# Altium schematic sheet LV_Schematic.SchDoc
size A3; SheetNumber: 1; SheetTotal: 1
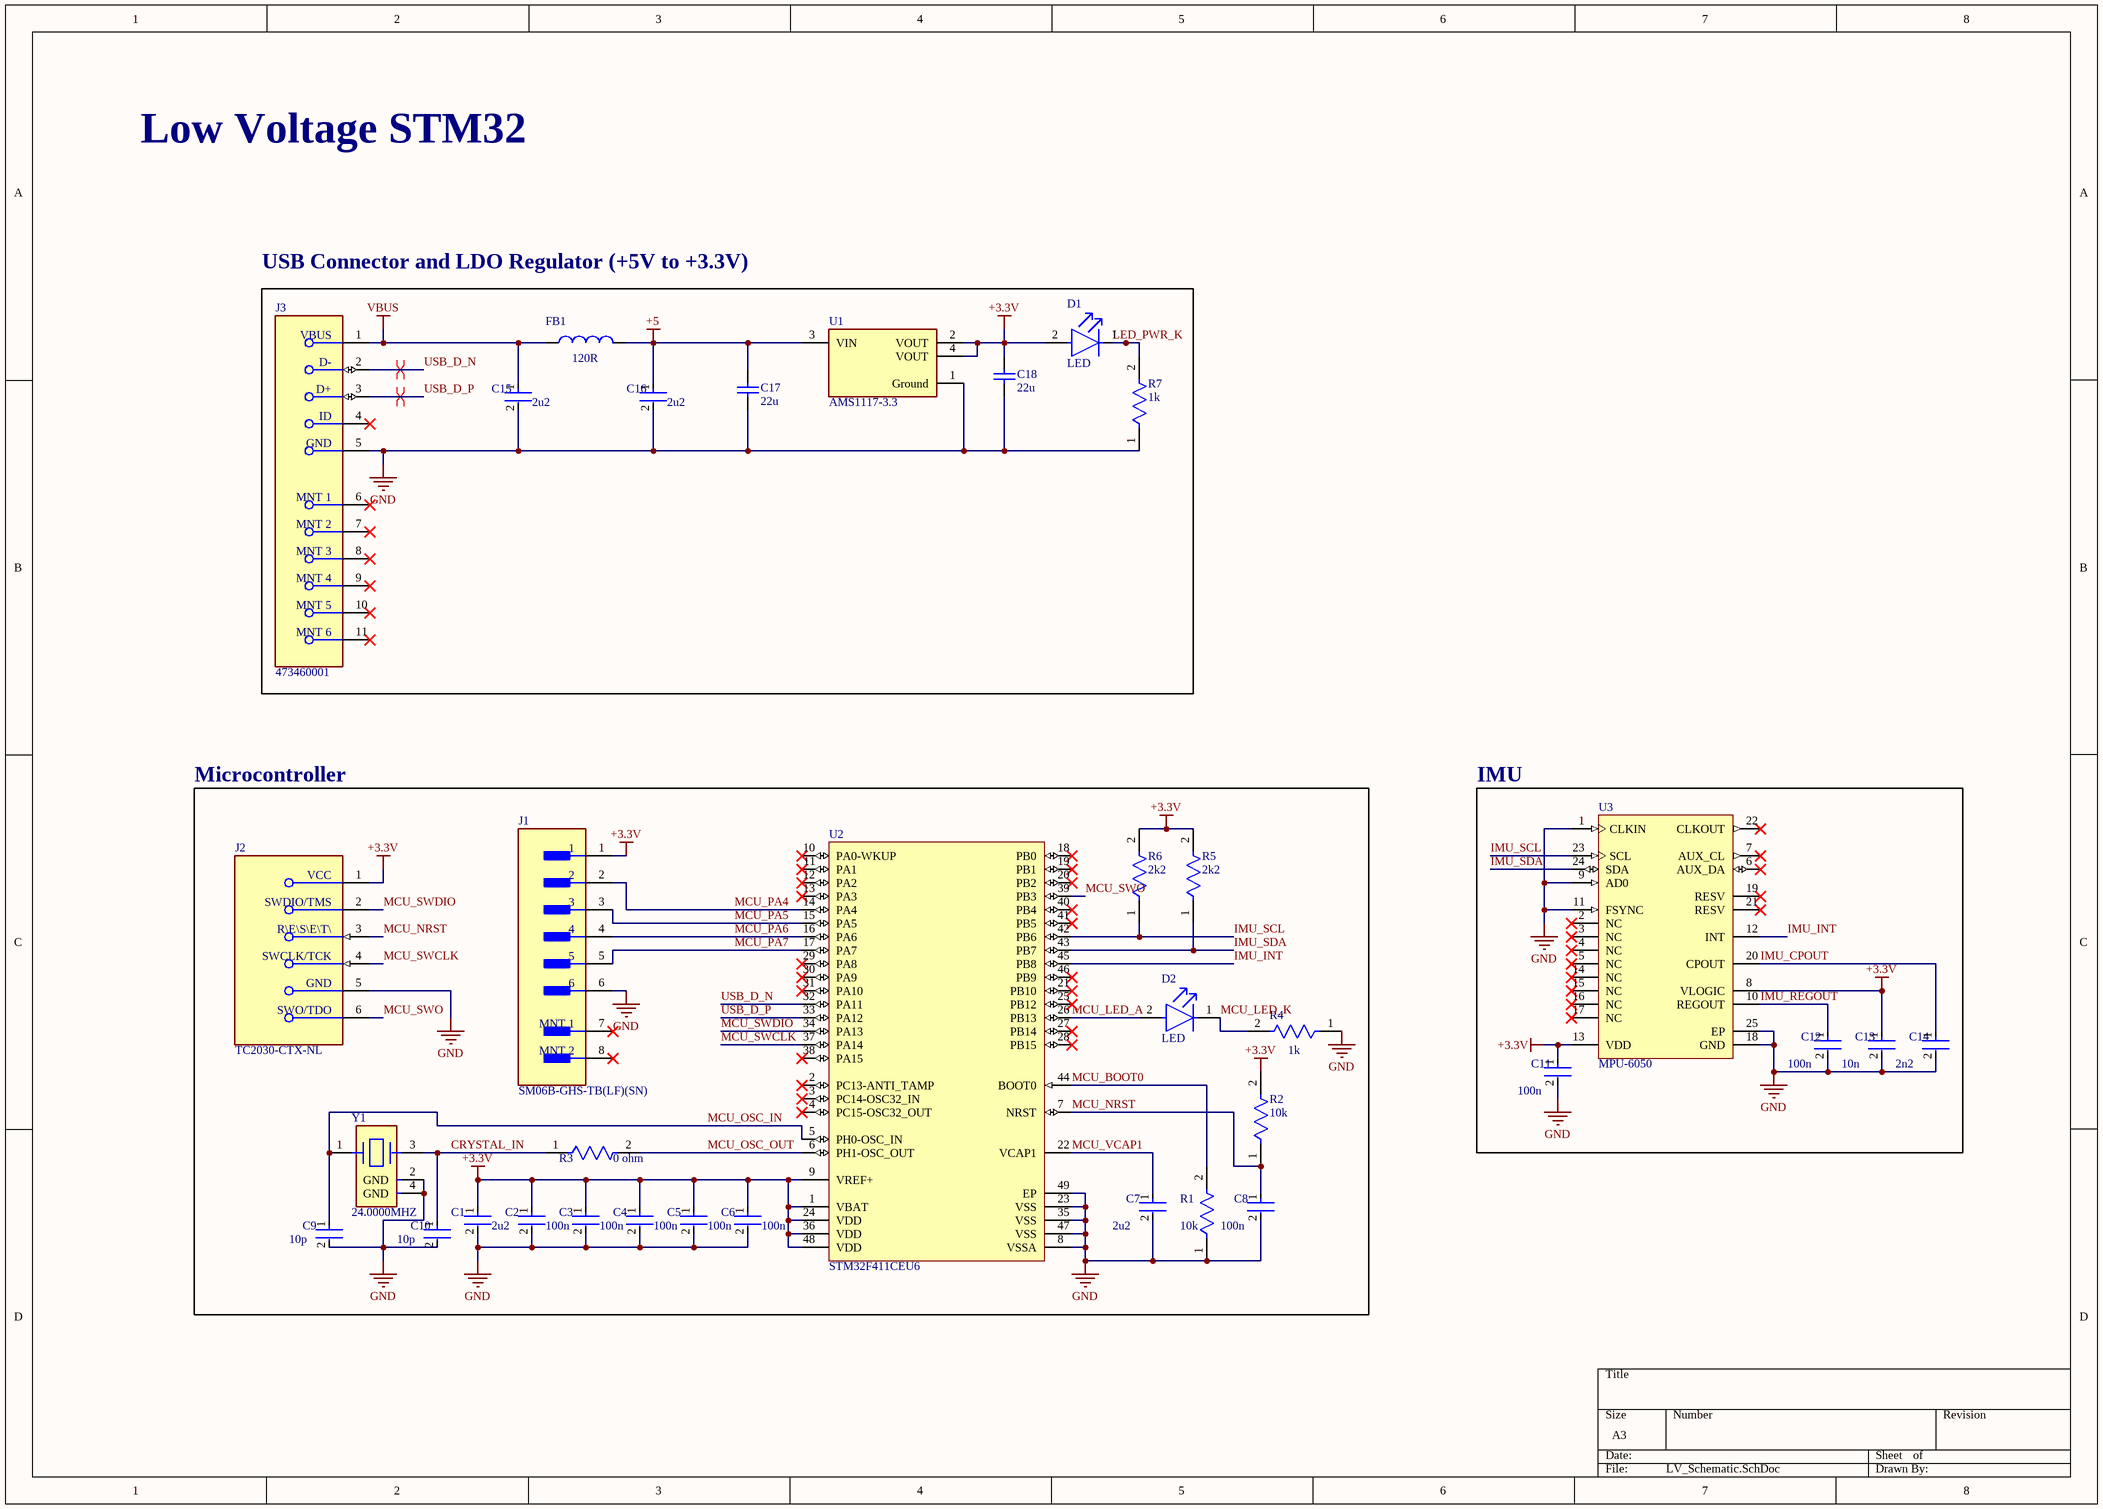
[diagram p0: LV_Schematic.SchDoc]

## Parts
C1  2u2  [FP-0603-L_1_6_0_15-W_0_8-IPC_A]
C2  100n  [FP-CC0402-MFG]
C3  100n  [FP-CC0402-MFG]
C4  100n  [FP-CC0402-MFG]
C5  100n  [FP-CC0402-MFG]
C6  100n  [FP-CC0402-MFG]
C7  2u2  [FP-0603-L_1_6_0_15-W_0_8-IPC_A]
C8  100n  [FP-CC0402-MFG]
C9  10p  [FP-CC0402-MFG]
C10  10p  [FP-CC0402-MFG]
C11  100n  [FP-CC0402-MFG]
C12  100n  [FP-CC0402-MFG]
C13  10n  [FP-CC0402-MFG]
C14  2n2  [FP-CC0402-MFG]
C15  2u2  [FP-0603-L_1_6_0_15-W_0_8-IPC_A]
C16  2u2  [FP-0603-L_1_6_0_15-W_0_8-IPC_A]
C17  22u  [CAPC2013X152X50ML20T25]
C18  22u  [CAPC2013X152X50ML20T25]
D1  LED  [FP-SML-LX0402SOC-TR-MFG]
D2  LED  [FP-SML-LX0402SOC-TR-MFG]
FB1  120R  [WE-CBF HF_0603_HC]
J1  SM06B-GHS-TB(LF)(SN)  [FP-SM06B-GHS-TB_LF_SN-MFG]
J2  TC2030-CTX-NL  [FP-TC2030-CTX-NL-MFG]
J3  473460001  [FP-473460001-MFG]
R1  10k  [FP-AC0402-MFG]
R2  10k  [FP-AC0402-MFG]
R3  0 ohm  [FP-AC0402-MFG]
R4  1k  [FP-AC0402-MFG]
R5  2k2  [FP-AC0402-MFG]
R6  2k2  [FP-AC0402-MFG]
R7  1k  [FP-AC0402-MFG]
U1  AMS1117-3.3  [FP-AMS1117-IPC_C]
U2  STM32F411CEU6  [STM-UFQFPN48_L]
U3  MPU-6050  [IS-QFN-24_V]
Y1  24.0000MHZ  [FP-ABM8W-MFG]

## Blocks framed on the sheet
USB Connector and LDO Regulator (+5V to +3.3V): C15-C18 D1 FB1 J3 R7 U1
Microcontroller: C1-C10 D2 J1 J2 R1-R6 U2 Y1
IMU: C11-C14 U3

## Nets
+3.3V: C1.1 C2.1 C3.1 C4.1 C5.1 C6.1 C11.1 C13.1 C18.2 D1.2(A) J1.1 J2.1(VCC) R2.2 R5.2 R6.2 U1.2(VOUT) U1.4(VOUT) U2.1(VBAT) U2.9(VREF+) U2.24(VDD) U2.36(VDD) U2.48(VDD) U3.8(VLOGIC) U3.13(VDD)
+5: C16.1 C17.2 FB1.2 U1.3(VIN)
GND: C1.2 C2.2 C3.2 C4.2 C5.2 C6.2 C7.2 C8.2 C9.2 C10.2 C11.2 C12.2 C13.2 C14.2 C15.2 C16.2 C17.1 C18.1 J1.6 J2.5(GND) J3.5(GND) R1.1 R4.1 R7.1 U1.1(Ground) U2.8(VSSA) U2.23(VSS) U2.35(VSS) U2.47(VSS) U2.49(EP) U3.1(CLKIN) U3.9(AD0) U3.11(FSYNC) U3.18(GND) U3.25(EP) Y1.2(GND) Y1.4(GND)
VBUS: C15.1 FB1.1 J3.1(VBUS)
CRYSTAL_IN: C10.1 R3.1 Y1.3
IMU_CPOUT: C14.1 U3.20(CPOUT)
IMU_INT: U2.45(PB8) U3.12(INT)
IMU_REGOUT: C12.1 U3.10(REGOUT)
IMU_SCL: R6.1 U2.42(PB6) U3.23(SCL)
IMU_SDA: R5.1 U2.43(PB7) U3.24(SDA)
LED_PWR_K: D1.1(C) R7.2
MCU_BOOT0: R1.2 U2.44(BOOT0)
MCU_LED_A: D2.2(A) U2.26(PB13)
MCU_LED_K: D2.1(C) R4.2
MCU_NRST: C8.1 J2.3(~{RESET}) R2.1 U2.7(NRST)
MCU_OSC_IN: C9.1 U2.5(PH0-OSC_IN) Y1.1
MCU_OSC_OUT: R3.2 U2.6(PH1-OSC_OUT)
MCU_PA4: J1.2 U2.14(PA4)
MCU_PA5: J1.3 U2.15(PA5)
MCU_PA6: J1.4 U2.16(PA6)
MCU_PA7: J1.5 U2.17(PA7)
MCU_SWCLK: J2.4(SWCLK/TCK) U2.37(PA14)
MCU_SWDIO: J2.2(SWDIO/TMS) U2.34(PA13)
MCU_SWO: J2.6(SWO/TDO) U2.39(PB3)
MCU_VCAP1: C7.1 U2.22(VCAP1)
USB_D_N: J3.2(D-) U2.32(PA11)
USB_D_P: J3.3(D+) U2.33(PA12)

Not connected (* = marked no-connect by the designer): J1 7(MNT_1)* 8(MNT_2)*; J3 4(ID)* 6(MNT_1)* 7(MNT_2)* 8(MNT_3)* 9(MNT_4)* 10(MNT_5)* 11(MNT_6)*; U2 2(PC13-ANTI_TAMP)* 3(PC14-OSC32_IN)* 4(PC15-OSC32_OUT)* 10(PA0-WKUP)* 11(PA1)* 12(PA2)* 13(PA3)* 18(PB0)* 19(PB1)* 20(PB2)* 21(PB10)* 25(PB12)* 27(PB14)* 28(PB15)* 29(PA8)* 30(PA9)* 31(PA10)* 38(PA15)* 40(PB4)* 41(PB5)* 46(PB9)*; U3 2(NC)* 3(NC)* 4(NC)* 5(NC)* 6(AUX_DA)* 7(AUX_CL)* 14(NC)* 15(NC)* 16(NC)* 17(NC)* 19(RESV)* 21(RESV)* 22(CLKOUT)*

## Layout directives
differential pair; differential pair class DIFF_USB: USB_D_N, USB_D_P

## Notes on the sheet
- Low Voltage STM32

## Library data of the parts
C1 C7 C15 C16 = CMP-2000-06225-3: None; Voltage Rating (DC): 16V; Capacitance: 4.7uF; Tolerance: 10%; Dielectric: X5R; Case/Package: 0603; Length: 1.6mm; Case Code (Imperial): 0603; Resistor Type: Ceramic; Packaging: Tape and Reel; Min Operating Temperature: -55°C; Series: M; Construction: Flat; Termination: SMD/SMT; Max Operating Temperature: 85°C; Voltage Rating: 16V; Width: 0.8mm; Case Code (Metric): 1608; Number of Pins: 2; RoHS Compliant: Yes; REACH SVHC: No SVHC; Package Quantity: 1; Thickness: 0.035inch; Height: 0.8mm; Mount: Surface Mount
C2-C6 C8-C14 = CMP-03422-001312-1: CAP CER 0.1UF 16V X5R 0402; Manufacturer Part Number: CC0402MRX5R7BB104; Manufacturer: YAGEO; Value: 100 nF; Automotive Grade: NA; Material: Ceramic; Tolerance: 0.2; Temperature Coefficient: 30ppm/°C; Temperature: -55°C to +125°C; Footprint Url: http://www.yageo.com/exep/pages/download/literatures/UPY-C_GEN_24.pdf; Height: 0.55mm; Ipc Land Pattern Name: CAPC10050X50; Digikey Description: CAP CER 0.1UF 16V X5R 0402; Device Class L2: Capacitors; Mouser Description: Multilayer Ceramic Capacitors MLCC - SMD/SMT 100nF 16V X5R 20%; Octopart: https://octopart.com/cc0402mrx5r7bb104-yageo-33242280; ComponentLink2Description: Datasheet; Temperature Range Low: -55°C; RoHS: TRUE; Device Class L3: Ceramic Capacitors; Automotive: No; Temperature Characteristic: X5R; Temperature Range High: +125°C; Device Class L1: Passive Components; Package: CC0402; Lead Free: Yes; Voltage Rating: 16 V; Category: Cap; Capacitance: 100 nF; ComponentLink2URL: http://www.yageo.com/documents/recent/UPY-GP_NP0_16V-to-50V_16.pdf
C17 C18 = CMP-2007-04522-1: Manufacturer: AVX Interconnect / Elco; Part Number: 0805ZD226MAT2A
D1 D2 = CMP-57192-000002-1: LED ORANGE CLEAR SMD; Forward Voltage: 2V; Viewing Angle: 120°; Luminous Intensity: 120mcd; Wavelength: 610nm; Forward Current: 20mA; Number of LEDs: 1; Lens Color: Colorless; Max Operating Temperature: 85°C; Mount: Surface Mount; Lens Transparency: Clear; Lens Style: Clear; Case Code (Metric): 1005; Length: 1mm; Package Quantity: 1; Case Code (Imperial): 0402; Color: Orange; Illumination Color: Orange; Width: 0.5mm; Packaging: Tape and Reel; Test Current: 20mA; Min Operating Temperature: -40°C; Height: 0.5mm; Number of Pins: 2; Lead Free: Lead Free; Case/Package: 0402
FB1 = CMP-0220-00101-3: Ferrite Bead (emi Suppression), 1.6X0.8X0.8MM (0603), 600O Impedance At 100 Mhz; Current Rating: 400mA; DC Resistance (DCR): 220mΩ; Max Current Rating: 500mA; Impedance: 600Ω; Tolerance: 25%; Resistance: 350mΩ; Number of Lines: 1; Test Frequency: 100MHz; Height: 800µm; Min Operating Temperature: -55°C; Length: 1.6mm; Width: 800µm; Case Code (Imperial): 0603; Depth: 800µm; Number of Pins: 2; Case Code (Metric): 1608; Case/Package: SMD/SMT; Lead Free: Lead Free; Core Material: Ferrite; Max Operating Temperature: 125°C; Termination: SMD/SMT; RoHS: Compliant; REACH SVHC: Unknown; Max DC Current: 500mA; Mount: Surface Mount
J1 = CMP-17439-000061-1: CONN HEADER SMD R/A 6POS 1.25MM; Number of Contacts: 6; Voltage Rating: 50V; Current Rating: 1A; Connector Type: Outer Shroud Contact; Contact Resistance: 50mR; Orientation: Right Angle; Max Operating Temperature: 85°C; Mount: Surface Mount; Packaging: Tape and Reel; Contact Plating: Tin; Depth: 4.05mm; Max Voltage Rating (AC): 50V; Lead Free: Lead Free; Pitch: 1.25mm; Number of Positions: 6; Max Current Rating: 1A; Termination: Solder; Min Operating Temperature: -25°C; Housing Color: Beige; Fastening Type: Ramp; Length: 10.75mm; Color: Natural; Contact Material: Bronze; Housing Material: Polyamide; Number of Rows: 1
J2 = CMP-205963-000001-1: 6-Pin “No legs” TC2030 Plug-of-Nails™ Cable for use with ARM Cortex processors
J3 = CMP-2000-05246-2: CONN RCPT USB2.0 MICRO B SMD R/A; Manufacturer: Molex; Conn Orientation: Right Angle; Is Female: yes; Shielding: true; Pitch: 0.65mm; Number Of Contacts: 5; Voltage Rating: 30V; Current Rating: 1.8A; Device Class L2: USB Connectors; Digikey Description: CONN RCPT USB2.0 MICRO B SMD R/A; Height: 2.945mm; RoHS: TRUE; ComponentLink2Description: Datasheet; Octopart: https://octopart.com/47346-0001-molex-7164928; Automotive: No; Package: 0; Category: Conn; Device Class L1: Connectors; Usb Standard: USB 2.0; Temperature: -30°C to +85°C; Temperature Range Low: -30°C; Footprint Url: https://www.molex.com/pdm_docs/sd/473460001_sd.pdf; ComponentLink2URL: https://www.molex.com/webdocs/datasheets/pdf/en-us/0473460001_IO_CONNECTORS.pdf; Lead Free: Yes; Manufacturer Part Number: 473460001; Contact Material: Gold,Nickel; Temperature Range High: +85°C; Device Class L3: unset
R1-R7 = CMP-03412-025001-2: RES 11.3kΩ ±0.5% 0.063W 0402; RoHS Compliant: Yes
U1 = CMP-209535-000001-1: LDO Voltage Regulators 1A, 3.3V; Manufacturer: Advanced Monolithic Systems; Dropout Voltage: 1.1V; Output Type: Fixed; Nominal Supply Current: 5mA; Max Power Dissipation: 1.2W; Max Supply Voltage: 15V; Number Of Outputs: 1; Standoff Height: 0.64mm; Max Junction Temp: +125°C; Height: 1.8mm; Package: AMS1117; Device Class L2: Power Management ICs; ComponentLink2Description: Datasheet; ComponentLink2URL: http://www.advanced-monolithic.com/pdf/ds1117.pdf; Category: IC; RoHS: TRUE; Automotive: No; Device Class L1: Integrated Circuits (ICs); Output Current: 1A; Device Class L3: Voltage Regulators - Linear; Temperature: -40°C to +125°C; Output Voltage: 3.3V; Manufacturer Part Number: AMS1117-3.3; Temperature Range Low: -40°C; Octopart: https://octopart.com/ams1117-3.3-advanced+monolithic+systems-25899300; Lead Free: Yes; Ipc Land Pattern Name: SOT229P700X180-4; Temperature Range High: +125°C
U2 = CMP-0243-00165-1: ARM Cortex-M4 32-bit MCU+FPU, 512 KB Flash, 128 KB RAM, 36 I/Os, 48-Pin UFQFPN, -40 to 85 degC, Tray; Operating Frequency(F) (Processor speed) (MHz): 100; FLASH Size (Prog) (kB): 512; Internal RAM Size (kB): 128; I/Os (High Current): 36; Supply Voltage(Vcc) min (V): 1.7; Package Reference: 48-Pin Ultra Thin Fine Pitch Quad Flat No-Lead, 7 x 7 x 0.6 mm Body, 0.5 mm Pitch, Exposed Pad; ComponentLink1Description: Manufacturer URL; ComponentLink1URL: http://www.st.com/; Packing: Tray; Package Description: UFQFPN48; Core: ARM Cortex-M4; ComponentLink2Description: Datasheet; ComponentLink2URL: http://www.st.com/st-web-ui/static/active/en/resource/technical/document/datasheet/DM00115249.pdf; DatasheetVersion: Rev. 6; Mounting Technology: Surface Mount
U3 = CMP-1753-00002-2: 3-Axis Gyroscope, Accelerometer and a Digital Motion Processor(TM) (DMP), 2.375 to 3.46 V, -40 to 85 degC, 24-Pin QFN, RoHS, Tape and Reel; Manufacturer: InvenSense; Featured Product: MPU-60506-Axis,IntegratedI²CSolution; Other Names: 1428-1007-2 / MPU6050; Sensor Type: MotionTracking; Online Catalog: MPU-6000™Series; Unit PriceUSD: Digital; Datasheet Version: Rev. 3.3, 05/2012; Category: Sensors,Transducers; Datasheet URL: http://datasheet.octopart.com/MPU-6050-InvenSense-datasheet-14421344.pdf; Family: Multifunction; Standard Package: 5,000; Manufacturer URL: http://www.invensense.com/; Output Type: Digital; Dynamic Catalog: MPU-6000™Series
Y1 = CMP-27762-013939-3: Crystal 24MHz ±10ppm (Tol) ±10ppm (Stability) 7pF FUND 50Ω 4-Pin SMD T/R